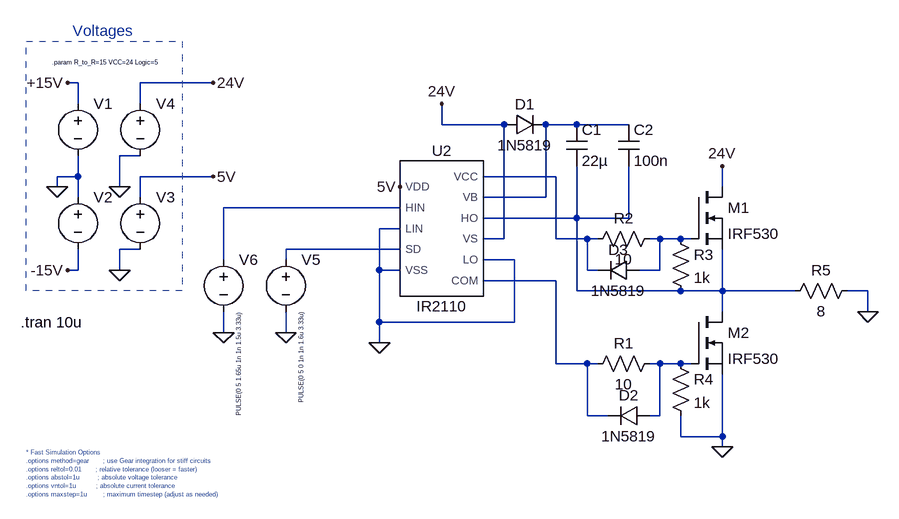
[diagram p0: schematic Test (If Spice works) IR2110.asc]
Test (If Spice works) IR2110.asc, the LTspice schematic file:
Version 4.1
SHEET 1 1764 872
WIRE -16 64 -32 64
WIRE 192 64 80 64
WIRE -16 96 -16 64
WIRE 80 96 80 64
WIRE 544 128 544 96
WIRE 640 128 544 128
WIRE 752 128 704 128
WIRE 832 128 752 128
WIRE 80 176 48 176
WIRE -16 208 -16 176
WIRE -16 208 -48 208
WIRE 192 208 80 208
WIRE 720 208 608 208
WIRE -48 224 -48 208
WIRE 48 224 48 176
WIRE 976 224 976 192
WIRE -16 240 -16 208
WIRE 80 240 80 208
WIRE 704 240 704 128
WIRE 704 240 608 240
WIRE 480 256 208 256
WIRE 752 272 752 192
WIRE 752 272 608 272
WIRE 832 272 832 192
WIRE 832 272 752 272
WIRE 480 288 448 288
WIRE 640 304 640 128
WIRE 640 304 608 304
WIRE 720 304 720 208
WIRE 768 304 720 304
WIRE 784 304 768 304
WIRE 880 304 864 304
WIRE 912 304 880 304
WIRE 928 304 912 304
WIRE 80 320 48 320
WIRE 480 320 304 320
WIRE 208 336 208 256
WIRE 304 336 304 320
WIRE 656 336 608 336
WIRE -16 352 -16 320
WIRE -16 352 -32 352
WIRE 48 352 48 320
WIRE 448 352 448 288
WIRE 480 352 448 352
WIRE 768 352 768 304
WIRE 784 352 768 352
WIRE 880 352 880 304
WIRE 880 352 848 352
WIRE 720 368 608 368
WIRE 752 384 752 272
WIRE 912 384 752 384
WIRE 976 384 976 320
WIRE 976 384 912 384
WIRE 1088 384 976 384
WIRE 1200 384 1168 384
WIRE 976 416 976 384
WIRE 1200 416 1200 384
WIRE 448 432 448 352
WIRE 656 432 656 336
WIRE 656 432 448 432
WIRE 208 448 208 416
WIRE 304 448 304 416
WIRE 448 464 448 432
WIRE 720 496 720 368
WIRE 768 496 720 496
WIRE 784 496 768 496
WIRE 880 496 864 496
WIRE 912 496 880 496
WIRE 928 496 912 496
WIRE 768 576 768 496
WIRE 800 576 768 576
WIRE 880 576 880 496
WIRE 880 576 864 576
WIRE 912 608 912 576
WIRE 976 608 976 512
WIRE 976 608 912 608
WIRE 976 624 976 608
FLAG -32 64 +15V
FLAG -32 352 -15V
FLAG -48 224 0
FLAG 192 208 5V
FLAG 192 64 24V
FLAG 48 224 0
FLAG 48 352 0
FLAG 480 224 5V
FLAG 304 448 0
FLAG 208 448 0
FLAG 448 464 0
FLAG 544 96 24V
FLAG 976 624 0
FLAG 976 192 24V
FLAG 1200 416 0
SYMBOL voltage -16 80 R0
WINDOW 3 24 96 Invisible 2
WINDOW 123 0 0 Left 0
WINDOW 39 0 0 Left 0
SYMATTR Value {R_to_R}
SYMATTR InstName V1
SYMBOL voltage -16 224 R0
WINDOW 3 24 96 Invisible 2
WINDOW 123 0 0 Left 0
WINDOW 39 0 0 Left 0
SYMATTR Value {R_to_R}
SYMATTR InstName V2
SYMBOL voltage 80 224 R0
WINDOW 3 24 96 Invisible 2
WINDOW 123 0 0 Left 0
WINDOW 39 0 0 Left 0
SYMATTR Value {Logic}
SYMATTR InstName V3
SYMBOL voltage 80 80 R0
WINDOW 3 24 44 Invisible 2
WINDOW 123 0 0 Left 0
WINDOW 39 0 0 Left 0
SYMATTR Value {VCC}
SYMATTR InstName V4
SYMBOL voltage 304 320 R0
WINDOW 3 24 96 VRight 0
WINDOW 123 0 0 Left 0
WINDOW 39 0 0 Left 0
SYMATTR Value PULSE(0 5 0 1n 1n 1.6u 3.33u)
SYMATTR InstName V5
SYMBOL voltage 208 320 R0
WINDOW 3 24 96 VRight 0
WINDOW 123 0 0 Left 0
WINDOW 39 0 0 Left 0
SYMATTR Value PULSE(0 5 1.65u 1n 1n 1.5u 3.33u)
SYMATTR InstName V6
SYMBOL diode 640 144 R270
WINDOW 0 32 32 VTop 2
WINDOW 3 0 32 VBottom 2
SYMATTR InstName D1
SYMATTR Value 1N5819
SYMBOL cap 736 128 R0
SYMATTR InstName C1
SYMATTR Value 22µ
SYMATTR SpiceLine Rser=.1
SYMBOL cap 816 128 R0
SYMATTR InstName C2
SYMATTR Value 100n
SYMATTR SpiceLine Rser=.1
SYMBOL res 768 512 R270
WINDOW 0 32 56 VTop 2
WINDOW 3 0 56 VBottom 2
SYMATTR InstName R1
SYMATTR Value 10
SYMBOL res 880 288 R90
WINDOW 0 0 56 VBottom 2
WINDOW 3 32 56 VTop 2
SYMATTR InstName R2
SYMATTR Value 10
SYMBOL res 896 288 R0
SYMATTR InstName R3
SYMATTR Value 1k
SYMBOL res 896 480 R0
SYMATTR InstName R4
SYMATTR Value 1k
SYMBOL res 1072 400 R270
WINDOW 0 32 56 VTop 2
WINDOW 3 0 56 VBottom 2
SYMATTR InstName R5
SYMATTR Value 8
SYMBOL diode 864 560 R90
WINDOW 0 0 32 VBottom 2
WINDOW 3 32 32 VTop 2
SYMATTR InstName D2
SYMATTR Value 1N5819
SYMBOL diode 848 336 R90
WINDOW 0 0 32 VBottom 2
WINDOW 3 32 32 VTop 2
SYMATTR InstName D3
SYMATTR Value 1N5819
SYMBOL nmos 928 224 R0
SYMATTR InstName M1
SYMATTR Value IRF530
SYMBOL nmos 928 416 R0
SYMATTR InstName M2
SYMATTR Value IRF530
SYMBOL ZmySymbol\\IC\\IR2110 544 288 R0
SYMATTR InstName U2
TEXT -56 32 Left 0 !.param R_to_R=15 VCC=24 Logic=5
TEXT -24 -16 Left 2 ;Voltages
TEXT -104 432 Left 2 !.tran 10u
TEXT -96 632 Left 0 ;* Fast Simulation Options\n.options method=gear       ; use Gear integration for stiff circuits\n.options reltol=0.01       ; relative tolerance (looser = faster)\n.options abstol=1u         ; absolute voltage tolerance\n.options vntol=1u          ; absolute current tolerance\n.options maxstep=1u        ; maximum timestep (adjust as needed)
RECTANGLE Normal 144 384 -96 0 2

The netlist it stands for:
* Test (If Spice works) IR2110.asc
V1 +15V 0 {R_to_R}
V2 0 -15V {R_to_R}
V3 5V 0 {Logic}
V4 24V 0 {VCC}
V5 N006 0 PULSE(0 5 0 1n 1n 1.6u 3.33u)
V6 N003 0 PULSE(0 5 1.65u 1n 1n 1.5u 3.33u)
D1 24V N001 1N5819
C1 N001 N004 22µ Rser=.1
C2 N001 N004 100n Rser=.1
R1 N007 N008 10
R2 N005 N002 10
R3 N005 N004 1k
R4 N008 0 1k
R5 N004 0 8
D2 N008 N007 1N5819
D3 N005 N002 1N5819
M1 24V N005 N004 N004 IRF530
M2 N004 N008 0 0 IRF530
X§U2 0 N004 N007 0 0 N003 N002 N001 24V 5V N006 IR2110  ; pins LO HO COM VSS LIN HIN VCC VB VS VDD SD
.model D D
.lib standard.dio
.model NMOS NMOS
.model PMOS PMOS
.lib standard.mos
.param R_to_R=15 VCC=24 Logic=5
* Voltages
.tran 10u
* * Fast Simulation Options
* .options method=gear       ; use Gear integration for stiff circuits
* .options reltol=0.01       ; relative tolerance (looser = faster)
* .options abstol=1u         ; absolute voltage tolerance
* .options vntol=1u          ; absolute current tolerance
* .options maxstep=1u        ; maximum timestep (adjust as needed)
.lib IR2110.lib
.backanno
.end